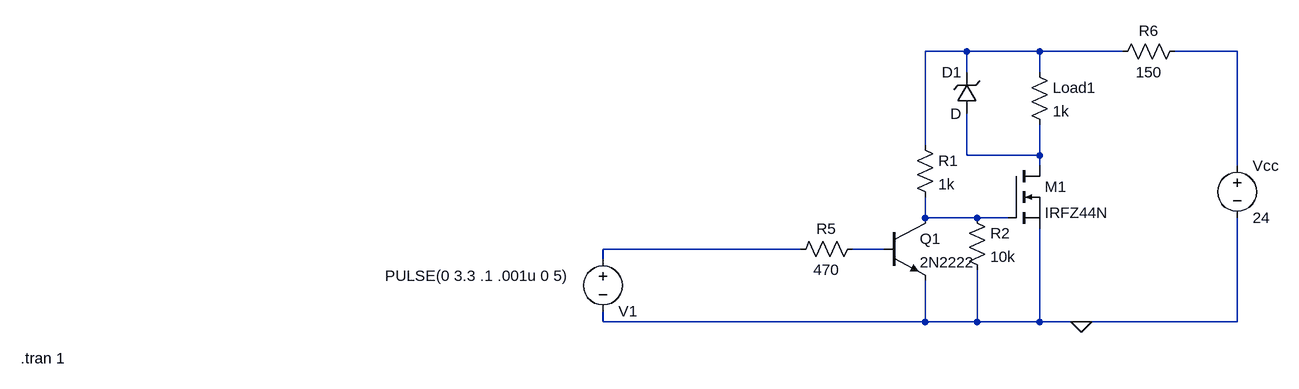
[diagram p0: schematic relay_switches.asc]
relay_switches.asc, the LTspice schematic file:
Version 4
SHEET 1 1220 680
WIRE 736 -80 672 -80
WIRE 848 -80 736 -80
WIRE 976 -80 848 -80
WIRE 1152 -80 1056 -80
WIRE 736 -48 736 -80
WIRE 848 -48 848 -80
WIRE 672 64 672 -80
WIRE 736 80 736 16
WIRE 848 80 848 32
WIRE 848 80 736 80
WIRE 848 96 848 80
WIRE 1152 96 1152 -80
WIRE 672 176 672 144
WIRE 752 176 672 176
WIRE 800 176 752 176
WIRE 480 224 176 224
WIRE 608 224 560 224
WIRE 176 240 176 224
WIRE 176 336 176 320
WIRE 672 336 672 272
WIRE 672 336 176 336
WIRE 752 336 752 256
WIRE 752 336 672 336
WIRE 848 336 848 192
WIRE 848 336 752 336
WIRE 912 336 848 336
WIRE 1152 336 1152 176
WIRE 1152 336 912 336
FLAG 912 336 0
SYMBOL voltage 1152 80 R0
WINDOW 123 0 0 Left 0
WINDOW 39 0 0 Left 0
SYMATTR InstName Vcc
SYMATTR Value 24
SYMBOL voltage 176 224 R0
WINDOW 0 24 96 Left 2
WINDOW 3 -335 41 Left 2
WINDOW 123 0 0 Left 0
WINDOW 39 0 0 Left 0
SYMATTR InstName V1
SYMATTR Value PULSE(0 3.3 .1 .001u 0 5)
SYMBOL res 832 -64 R0
SYMATTR InstName Load1
SYMATTR Value 1k
SYMBOL nmos 800 96 R0
SYMATTR InstName M1
SYMATTR Value IRFZ44N
SYMBOL res 736 160 R0
SYMATTR InstName R2
SYMATTR Value 10k
SYMBOL res 576 208 R90
WINDOW 0 0 56 VBottom 2
WINDOW 3 32 56 VTop 2
SYMATTR InstName R5
SYMATTR Value 470
SYMBOL res 1072 -96 R90
WINDOW 0 0 56 VBottom 2
WINDOW 3 32 56 VTop 2
SYMATTR InstName R6
SYMATTR Value 150
SYMBOL npn 608 176 R0
SYMATTR InstName Q1
SYMATTR Value 2N2222
SYMBOL res 656 48 R0
SYMATTR InstName R1
SYMATTR Value 1k
SYMBOL zener 752 16 R180
WINDOW 0 24 64 Left 2
WINDOW 3 24 0 Left 2
SYMATTR InstName D1
TEXT -720 392 Left 2 !.tran 1

The netlist it stands for:
* relay_switches.asc
Vcc N002 0 24
V1 N005 0 PULSE(0 3.3 .1 .001u 0 5)
R§Load1 N001 N003 1k
M1 N003 N004 0 0 IRFZ44N
R2 N004 0 10k
R5 N006 N005 470
R6 N002 N001 150
Q1 N004 N006 0 0 2N2222
R1 N001 N004 1k
D1 N003 N001 D
.model D D
.lib standard.dio
.model NPN NPN
.model PNP PNP
.lib standard.bjt
.model NMOS NMOS
.model PMOS PMOS
.lib standard.mos
.tran 1
.backanno
.end